# EAGLE design energy (EAGLE 8.3.2)
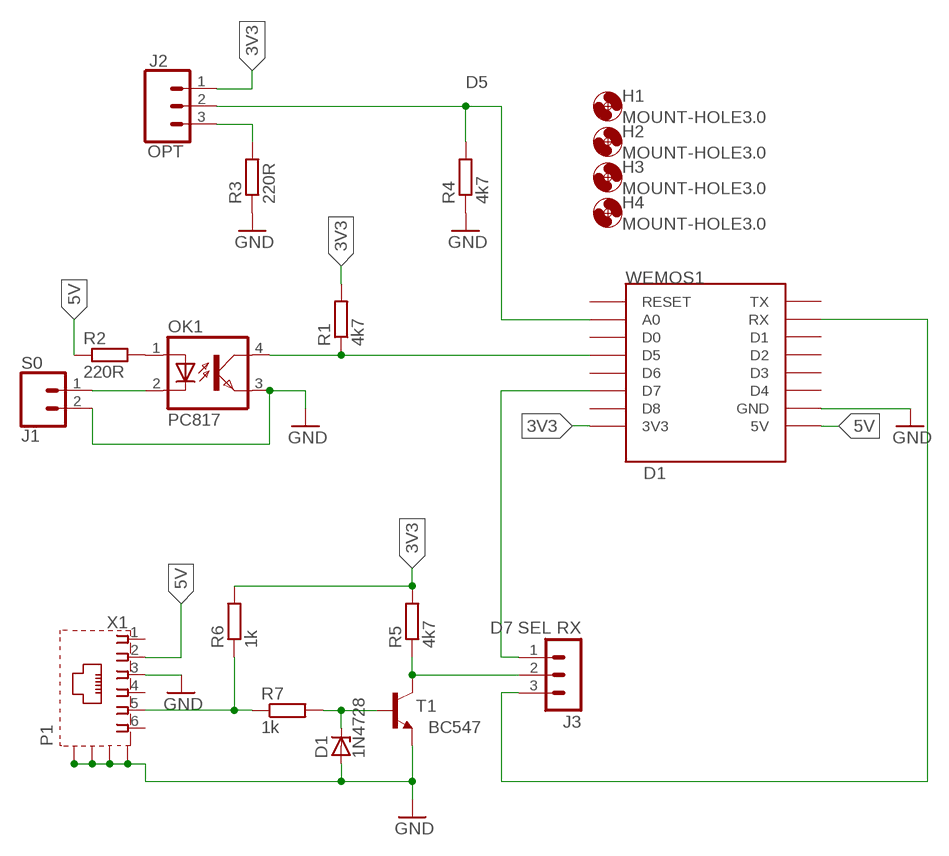
[diagram p0: schematic, sheet 1]

## Parts
D1  1N4728  [DO41Z10]
H1  MOUNT-HOLE3.0  [3,0]
H2  MOUNT-HOLE3.0  [3,0]
H3  MOUNT-HOLE3.0  [3,0]
H4  MOUNT-HOLE3.0  [3,0]
J1  S0  CONN_023.5MM  [SCREWTERMINAL-3.5MM-2]
J2  OPT  CONN_03SCREW  [SCREWTERMINAL-3.5MM-3]
J3  D7 SEL RX  MA03-1  [MA03-1]
OK1  PC817  [DIL04]
R1  4k7  R-EU_0207/10  [0207/10]
R2  220R  R-EU_0207/10  [0207/10]
R3  220R  R-EU_0207/10  [0207/10]
R4  4k7  R-EU_0207/10  [0207/10]
R5  4k7  R-EU_0207/10  [0207/10]
R6  1k  R-EU_0207/10  [0207/10]
R7  1k  R-EU_0207/10  [0207/10]
T1  BC547  [TO92]
WEMOS1  D1  WEMOS-D1-MINI  [WEMOS-D1-MINI]
X1  P1  RJ11-6LCT2-B  [RJ11-SHIELD2]

## Nets
3V3 [3V3]: J2.1 R1.2 R5.2 R6.2 WEMOS1.3V3
5V [5V]: R2.1 WEMOS1.5V X1.2
D5: OK1.4(COL) R1.1 WEMOS1.D5
D7: J3.2 R5.1 T1.3(C)
GND [GND]: D1.A J1.2 OK1.3(EMIT) R3.1 R4.1 T1.1(E) WEMOS1.GND X1.3 X1.S1(S) X1.S2(S) X1.S3(S) X1.S4(S)
N$1: D1.C R7.2 T1.2(B)
N$2: J1.1 OK1.2(C)
N$3: J2.3 R3.2
N$4: R6.1 R7.1 X1.5
N$5: J3.1 WEMOS1.D7
N$6: J3.3 WEMOS1.RX
N$8: OK1.1(A) R2.2
NPNOUT: J2.2 R4.2 WEMOS1.A0
Unconnected: WEMOS1.D0 WEMOS1.D1 WEMOS1.D2 WEMOS1.D3 WEMOS1.D4 WEMOS1.D6 WEMOS1.D8 WEMOS1.RESET WEMOS1.TX X1.1 X1.4 X1.6

## Library data of the parts
D1 = diode:1N4728: Z DIODE 3.3 V, 1W, 5 percent
H1-H4 = holes:MOUNT-HOLE: MOUNTING HOLE with drill center marker
J1 = SparkFun-Connectors:CONN_02: Multi connection point. Often used as Generic Header-pin footprint for 0.1 inch spaced/style header connections On any of the 0.1 inch spaced packages, you can populate with these: Break Away Headers - Straight <https://www.sparkfun.com/products/116> (PRT-00116) Break Away Male Headers - Right Angle <https://www.sparkfun.com/products/553> (PRT-00553) Female Headers <https://www.sparkfun.com/products/115> (PRT-00115) Break Away Headers - Machine Pin <https://www.sparkfun.com/products/117> (PRT-00117) Break Away Female Headers - Swiss Machine Pin <https://www.sparkfun.com/products/743> (PRT-00743) For SCREWTERMINALS and SPRING TERMINALS visit here: Screw Terimnals on SparkFun.com <https://www.sparkfun.com/search/results?term=Screw+Terminals> (5mm/3.5mm/2.54mm spacing) This device is also useful as a general connection point to wire up your design to another part of your project. Our various solder wires solder well into these plated through hole pads. Hook-Up Wire - Assortment (Stranded, 22 AWG) <https://www.sparkfun.com/products/11375> (PRT-11375) Hook-Up Wire - Assortment (Solid Core, 22 AWG) <https://www.sparkfun.com/products/11367> (PRT-11367) View the entire wire category on our website here <https://www.sparkfun.com/categories/141> Special notes: Molex polarized connector foot print use with: PRT-08233 with associated crimp pins and housings. 2.54_SCREWTERM for use with PRT-10571. 3.5mm Screw Terminal footprints for PRT-08084 5mm Screw Terminal footprints for use with PRT-08432; PROD_ID: CONN-08399
J2 = SparkFun-Connectors:CONN_03: Multi connection point. Often used as Generic Header-pin footprint for 0.1 inch spaced/style header connections On any of the 0.1 inch spaced packages, you can populate with these: Break Away Headers - Straight <https://www.sparkfun.com/products/116> (PRT-00116) Break Away Male Headers - Right Angle <https://www.sparkfun.com/products/553> (PRT-00553) Female Headers <https://www.sparkfun.com/products/115> (PRT-00115) Break Away Headers - Machine Pin <https://www.sparkfun.com/products/117> (PRT-00117) Break Away Female Headers - Swiss Machine Pin <https://www.sparkfun.com/products/743> (PRT-00743) Stackable Header - 3 Pin (Female, 0.1") <https://www.sparkfun.com/products/13875> (PRT-13875) For SCREWTERMINALS and SPRING TERMINALS visit here: Screw Terimnals on SparkFun.com <https://www.sparkfun.com/search/results?term=Screw+Terminals> (5mm/3.5mm/2.54mm spacing) This device is also useful as a general connection point to wire up your design to another part of your project. Our various solder wires solder well into these plated through hole pads. Hook-Up Wire - Assortment (Stranded, 22 AWG) <https://www.sparkfun.com/products/11375> (PRT-11375) Hook-Up Wire - Assortment (Solid Core, 22 AWG) <https://www.sparkfun.com/products/11367> (PRT-11367) View the entire wire category on our website here <https://www.sparkfun.com/categories/141> Special notes: Molex polarized connector foot print use with SKU : PRT-08232 with associated crimp pins and housings.; PROD_ID: CONN-08288; SF_ID: PRT-08235
J3 = con-lstb:MA03-1: PIN HEADER; OC_FARNELL: unknown; OC_NEWARK: unknown
OK1 = optocoupler:PC817: SHARP OPTO COUPLER; MPN: PC817X4J000F; OC_FARNELL: 9707727; OC_NEWARK: 97K7059
R1-R7 = resistor:R-EU_: RESISTOR, European symbol
T1 = transistor:BC547: NPN TRANSISTOR
WEMOS1 = esp8266modules:WEMOS-D1-MINI: WeMos.cc D1 mini ESP8266 module
X1 = con-tycoelectronics:RJ11*2: RJ11 (Style 1 Shield / Style 2 Shield) Source: www.tycoelectronics.com .. ENG_DS_1654001_1099_RJ_L_0507.pdf; MPN: RJ11-6LCT2-B; OC_FARNELL: unknown; OC_NEWARK: 16R6083

## Net classes
0 default: width 0.762 mm
1 5V: width 1.016 mm
2 12V: width 1.016 mm
3 GND: width 1.016 mm
4 3V3: width 1.016 mm

## Board
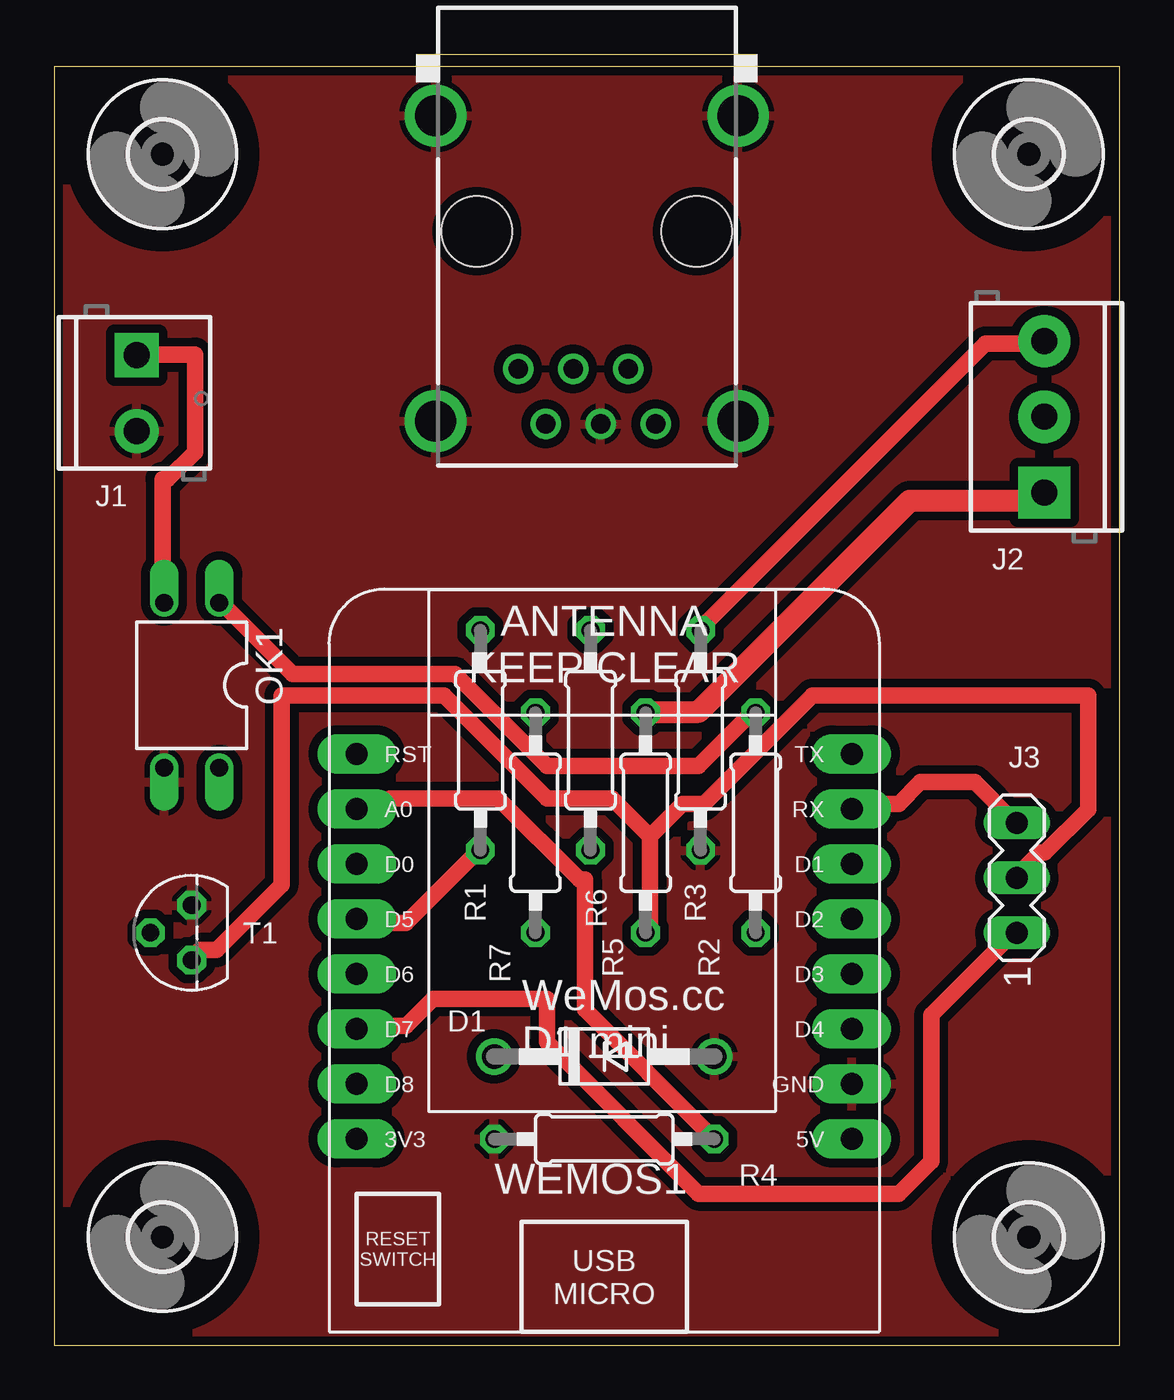
[diagram p1: board, top side]
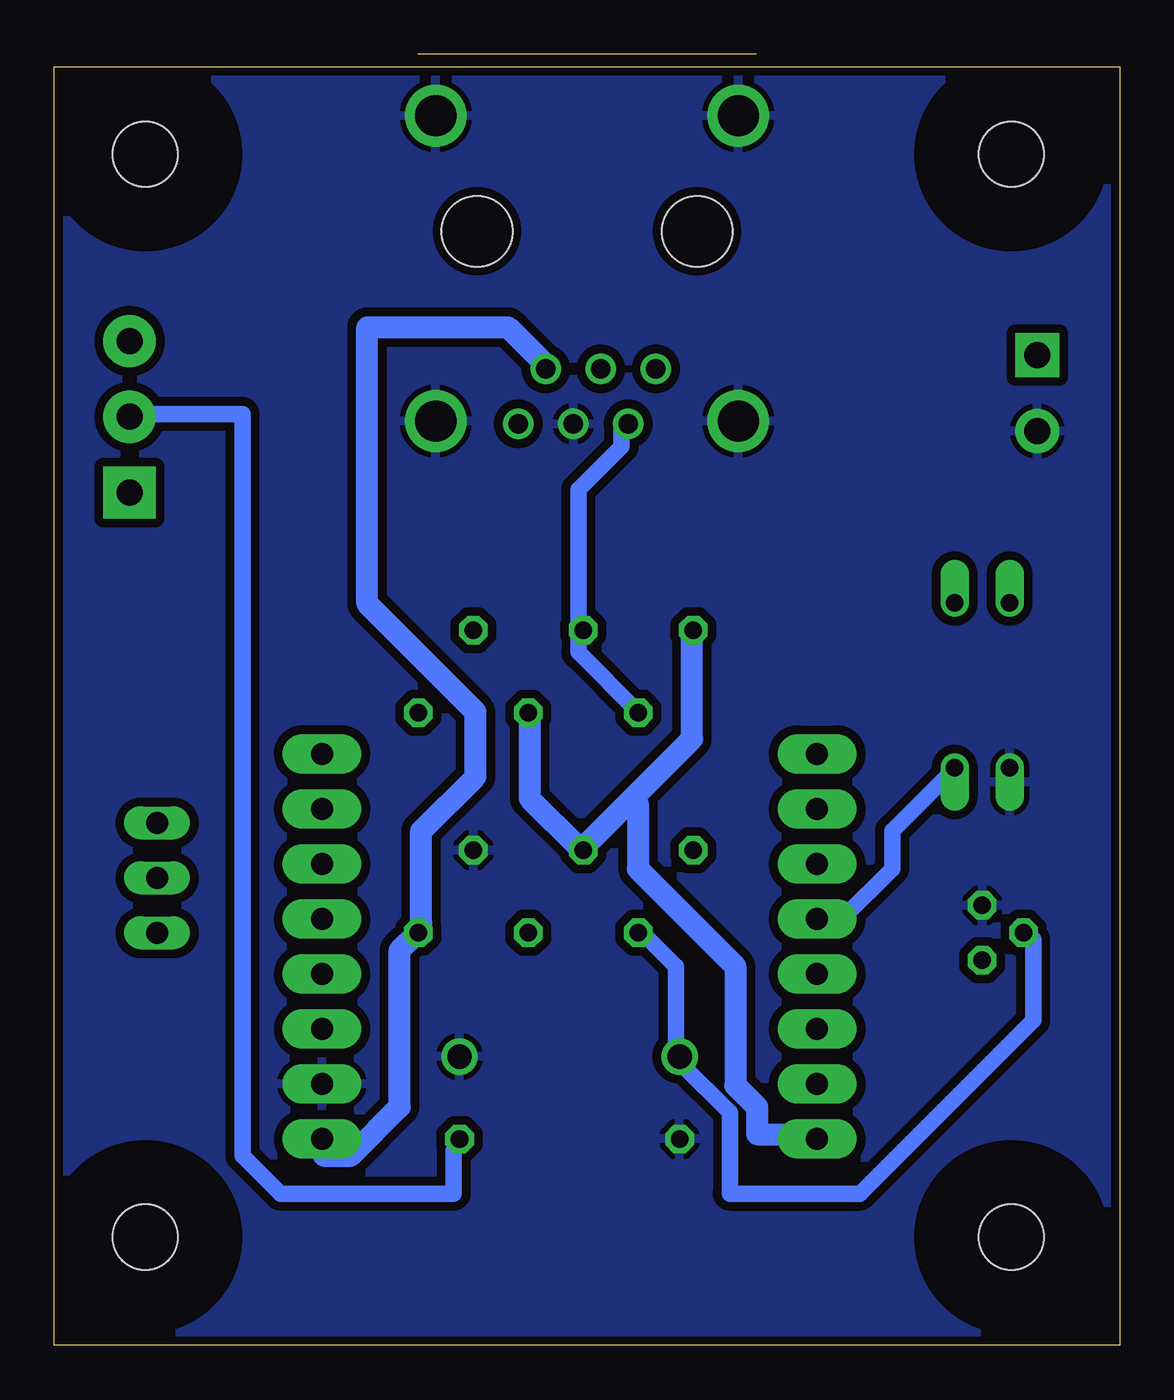
[diagram p2: board, bottom side, seen from below]

Size 49.2 x 59.05 mm. Coordinates in mm from the lower left corner, seen from the top.
Outline: 0,0 49.2,0 49.2,59.05 0,59.05 0,0
Copper layers (1*16): Top 0.035mm / dielectric 1.5mm / Bottom 0.035mm
Design rules "SeeedStudio_2layer_DRU_no_angle_20140221": minimum track width 6mil, minimum drill 12mil, track to track 6mil, track to pad 6mil, pad to pad 6mil, via to via 6mil, smd to smd 0mil, copper to edge 10mil, drill to drill 10mil, minimum pad ring 10mil, minimum via ring 6mil, stop-mask expansion 2mil, vias tented up to drill 100mil, thermal gap 10mil

### Footprints (pad centres in the part's own frame; a part is rotated, then mirrored left to right if it is on the bottom)
DO41Z10 = drill 1.118: A 5.08,0; C -5.08,0
3,0 = hole 3: 0,0
SCREWTERMINAL-3.5MM-2 = drill 1.2 pad 2.032 square: 1 0,0 | drill 1.2 pad 2.032: 2 3.5,0
SCREWTERMINAL-3.5MM-3 = drill 1.2 pad 2.413 square: 1 0,0 | drill 1.2 pad 2.413: 2 3.5,0; 3 7,0
MA03-1 = drill 1.016 long: 1 -2.54,0; 2 0,0; 3 2.54,0
DIL04 = drill 0.813 offset: 1 -1.27,-3.81; 2 1.27,-3.81; 3 1.27,3.81; 4 -1.27,3.81
0207/10 = drill 0.813 octagon: 1 -5.08,0; 2 5.08,0
TO92 = drill 0.813 octagon: 1 1.27,0; 2 0,1.905; 3 -1.27,0
WEMOS-D1-MINI = drill 1.016 pad 1.829 long: 3V3 -10.16,-10.16; 5V 12.7,-10.16; A0 -10.16,5.08; D0 -10.16,2.54; D1 12.7,2.54; D2 12.7,0; D3 12.7,-2.54; D4 12.7,-5.08; D5 -10.16,0; D6 -10.16,-2.54; D7 -10.16,-5.08; D8 -10.16,-7.62; GND 12.7,-7.62; RESET -10.16,7.62; RX 12.7,5.08; TX 12.7,7.62
RJ11-SHIELD2 = drill 0.9 pad 1.4: 1 -3.175,8.89; 2 -1.905,6.35; 3 -0.635,8.89; 4 0.635,6.35; 5 1.905,8.89; 6 3.175,6.35 | drill 1.9 pad 2.5: S1 -6.985,-5.334; S2 6.985,-5.334; S3 -6.985,8.763; S4 6.985,8.763 | hole 3.251: -5.08,0; 5.08,0

### Placement (x,y rotation side)
D1  25.4,13.34 0 top
H1  45,5 0 top
H2  5,5 0 top
H3  5,55 0 top
H4  45,55 0 top
J1  3.81,45.72 270 top
J2  45.72,39.37 90 top
J3  44.45,21.59 90 top
OK1  6.35,30.48 180 top
R1  19.68,27.94 90 top
R2  32.38,24.13 90 top
R3  29.84,27.94 90 top
R4  25.4,9.53 0 top
R5  27.3,24.13 90 top
R6  24.77,27.94 270 top
R7  22.23,24.13 270 top
T1  6.35,19.05 90 top
WEMOS1  24.13,19.68 0 top
X1  24.59,51.44 180 top

### Tracks (layer width: path | path; a pad name or v marks a point on that pad's centre or on a via)
3V3
  Top 1.016: J2.1 45.5,39.25 45.25,39 39.5,39 29.75,29.25 27.5,29.25 R5.2
  Bottom 1.016: R5.2 27.25,29 27.25,25.25 25,23 R6.2 24.5,23.25 22.5,25.25 | 22.5,25.25 19.75,28 19.75,33 R1.2 | WEMOS1.3V3 14,9.75 16.75,9.75 16.75,11 17.75,12 17.75,17.5 22.25,22 22.25,25 22.5,25.25
5V
  Bottom 1.016: WEMOS1.5V 36.75,9.5 36.75,8.75 35.5,8.75 33.25,11 33.25,18.25 32.5,19 R2.1 32.25,19.5 32.25,23.75 29.75,26.25 29.75,29.25 34.75,34.25 34.75,47 28.25,47 26.5,45.25 X1.2
D5
  Top 0.762: R1.1 19.5,22.75 16.25,19.5 14,19.5 WEMOS1.D5
  Bottom 0.762: OK1.4 7.75,26.5 10.5,23.75 10.5,22 12.75,19.75 13.75,19.75 WEMOS1.D5
D7
  Top 0.762: 27.5,23.5 25.75,25.25 22.75,25.25 18,30 10.5,30 10.5,21.25 7.5,18.25 6.75,18.25 6.5,18 T1.3 | 27.5,23.5 27.5,19.25 R5.1 | 27.5,23.5 29,25 30,25 35,30 47.75,30 47.75,24.75 45.75,22.75 45.5,22.75 44.5,21.75 J3.2
GND
  pour Top (isolate 0.406): 0,0 0,59.05 49.53,59.05 49.53,0
  pour Bottom (isolate 0.406): 0,0 0,59.05 49.53,59.05 49.53,0
N$1
  Bottom 0.762: T1.2 4.25,19 4,18.75 4,15 12,7 18,7 18,10.75 20.25,13 20.25,13.25 D1.C 20.5,13.5 20.5,17.5 22,19 R7.2
N$2
  Top 0.762: OK1.2 5,34.5 5,40 5.25,40 6.5,41.25 6.5,45.75 4,45.75 J1.1
N$3
  Top 0.762: R3.2 30,33.25 43,46.25 45.5,46.25 J2.3
N$4
  Bottom 0.762: R7.1 22.25,29.25 25,32 25,33 R6.1 25,33.25 25,39.5 23,41.5 23,42.25 22.75,42.5 X1.5
N$5
  Top 0.762: J3.1 44.25,19 40.5,15.25 40.5,8.5 39,7 29.75,7 22.75,14 22.75,16 17.5,16 16.25,14.75 14,14.75 WEMOS1.D7
N$6
  Top 0.762: J3.3 44.25,24.25 42.5,26 40,26 39,25 37,25 WEMOS1.RX
N$8
  Top 0.762: OK1.1 7.75,34.25 11,31 18.5,31 22.75,26.75 29.75,26.75 32,29 32.25,29 R2.2
NPNOUT
  Top 0.762: R4.2 30.25,9.75 24.5,15.5 24.5,21.5 24.25,21.5 20.5,25.25 15.5,25.25 15,24.75 14,24.75 WEMOS1.A0
  Bottom 0.762: J2.2 45.5,43 40.5,43 40.5,8.75 38.75,7 30.75,7 30.75,9 30.5,9.25 30.5,9.5 R4.2

### Text on the board
bValues: Utility Shield v0.4 | www.github.com/ajvdw